# EAGLE design nonary (EAGLE 9.5.2)
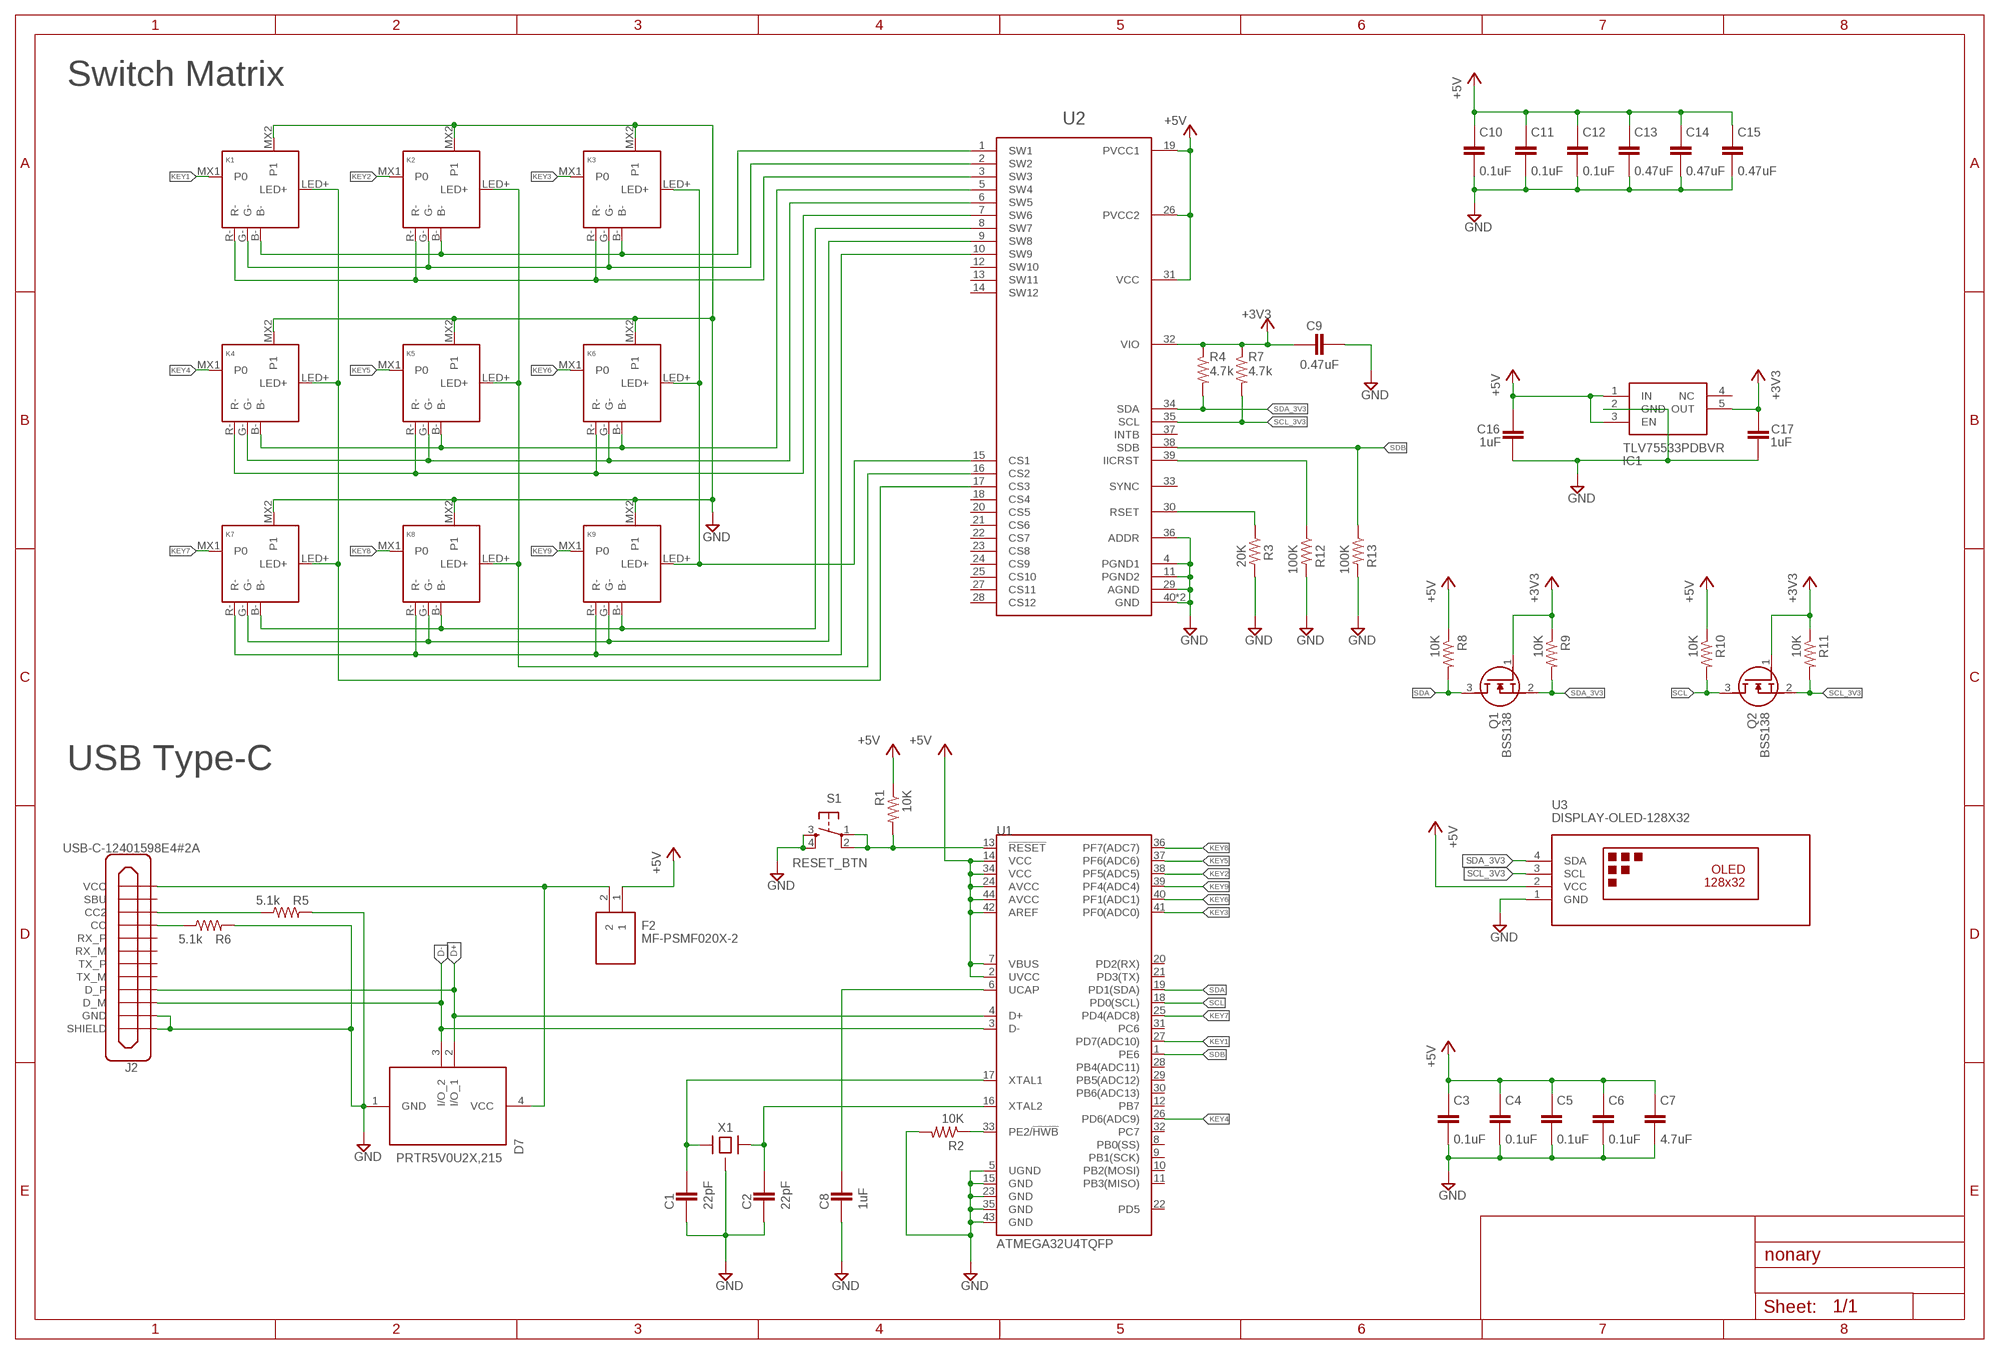
[diagram p0: schematic, sheet 1]

## Parts
C1  22pF  CAPACITOR-0603  [C0603]
C2  22pF  CAPACITOR-0603  [C0603]
C3  0.1uF  CAPACITOR-0603  [C0603]
C4  0.1uF  CAPACITOR-0603  [C0603]
C5  0.1uF  CAPACITOR-0603  [C0603]
C6  0.1uF  CAPACITOR-0603  [C0603]
C7  4.7uF  CAPACITOR-0603  [C0603]
C8  1uF  CAPACITOR-0603  [C0603]
C9  0.47uF  CAPACITOR-0603  [C0603]
C10  0.1uF  CAPACITOR-0603  [C0603]
C11  0.1uF  CAPACITOR-0603  [C0603]
C12  0.1uF  CAPACITOR-0603  [C0603]
C13  0.47uF  CAPACITOR-0603  [C0603]
C14  0.47uF  CAPACITOR-0603  [C0603]
C15  0.47uF  CAPACITOR-0603  [C0603]
C16  1uF  CAPACITOR-0603  [C0603]
C17  1uF  CAPACITOR-0603  [C0603]
D7  PRTR5V0U2X,215  [SOT-143B]
F2  MF-PSMF020X-2  [FUSC2214X85N]
IC1  TLV75533PDBVR  [SOT95P280X145-5N]
J2  USB-C-12401598E4#2A  [12401598E4#2A]
K1  KEYSWITCH-RGBSMDLED-MXHSPCB-1U-SMDRGB  [MXHSPCB-1U-SMDRGB]
K2  KEYSWITCH-RGBSMDLED-MXHSPCB-1U-SMDRGB  [MXHSPCB-1U-SMDRGB]
K3  KEYSWITCH-RGBSMDLED-MXHSPCB-1U-SMDRGB  [MXHSPCB-1U-SMDRGB]
K4  KEYSWITCH-RGBSMDLED-MXHSPCB-1U-SMDRGB  [MXHSPCB-1U-SMDRGB]
K5  KEYSWITCH-RGBSMDLED-MXHSPCB-1U-SMDRGB  [MXHSPCB-1U-SMDRGB]
K6  KEYSWITCH-RGBSMDLED-MXHSPCB-1U-SMDRGB  [MXHSPCB-1U-SMDRGB]
K7  KEYSWITCH-RGBSMDLED-MXHSPCB-1U-SMDRGB  [MXHSPCB-1U-SMDRGB]
K8  KEYSWITCH-RGBSMDLED-MXHSPCB-1U-SMDRGB  [MXHSPCB-1U-SMDRGB]
K9  KEYSWITCH-RGBSMDLED-MXHSPCB-1U-SMDRGB  [MXHSPCB-1U-SMDRGB]
Q1  BSS138  [SOT95P240X120-3N]
Q2  BSS138  [SOT95P240X120-3N]
R1  10K  R-US_R0603  [R0603]
R2  10K  R-US_R0603  [R0603]
R3  20K  R-US_R0603  [R0603]
R4  4.7k  R-US_R0603  [R0603]
R5  5.1k  R-US_R0603  [R0603]
R6  5.1k  R-US_R0603  [R0603]
R7  4.7k  R-US_R0603  [R0603]
R8  10K  R-US_R0603  [R0603]
R9  10K  R-US_R0603  [R0603]
R10  10K  R-US_R0603  [R0603]
R11  10K  R-US_R0603  [R0603]
R12  100K  R-US_R0603  [R0603]
R13  100K  R-US_R0603  [R0603]
S1  RESET_BTN  TAC_SWITCHSMD  [TACTILE-SWITCH-SMD]
U1  ATMEGA32U4TQFP  [SPARKFUN-DIGITALIC_TQFP44]
U2  IS31FL3737  [QFN-40]
U3  DISPLAY-OLED-128X32  [DISPLAY-OLED-128X32]
X1  CRYSTAL-4PIN-3.2X2.5  [CRYSTAL-3.2X2.5]

## Nets
+3V3: C9.1 C17.2 IC1.5(OUT) Q1.1(G) Q2.1(G) R4.1 R7.1 R9.1 R11.1 U2.32(VIO)
+5V: C3.2 C4.2 C5.2 C6.2 C7.2 C10.2 C11.2 C12.2 C13.2 C14.2 C15.2 C16.2 F2.1 IC1.1(IN) IC1.3(EN) R1.1 R8.1 R10.1 U1.2(UVCC) U1.7(VBUS) U1.14(VCC) U1.24(AVCC) U1.34(VCC) U1.42(AREF) U1.44(AVCC) U2.19(PVCC1) U2.26(PVCC2) U2.31(VCC) U3.2(VCC)
/RESET: R1.2 S1.1 S1.2 U1.13(!RESET)
CS1: K3.LED+ K6.LED+ K9.LED+ U2.15(CS1)
CS2: K2.LED+ K5.LED+ K8.LED+ U2.16(CS2)
CS3: K1.LED+ K4.LED+ K7.LED+ U2.17(CS3)
D+: D7.2(I/O_1) J2.A6(D_P) J2.B6(D_P) U1.4(D+)
D-: D7.3(I/O_2) J2.A7(D_M) J2.B7(D_M) U1.3(D-)
GND [VCC_5V]: C1.1 C2.1 C3.1 C4.1 C5.1 C6.1 C7.1 C8.1 C9.2 C10.1 C11.1 C12.1 C13.1 C14.1 C15.1 C16.1 C17.1 D7.1(GND) IC1.2(GND) J2.A1(GND) J2.A12(GND) J2.B1(GND) J2.B12(GND) J2.SHIELD@1(SHIELD) J2.SHIELD@2(SHIELD) J2.SHIELD@3(SHIELD) J2.SHIELD@4(SHIELD) K1.MX2(P1) K2.MX2(P1) K3.MX2(P1) K4.MX2(P1) K5.MX2(P1) K6.MX2(P1) K7.MX2(P1) K8.MX2(P1) K9.MX2(P1) R2.2 R3.2 R5.2 R6.2 R12.2 R13.2 S1.3 S1.4 U1.5(UGND) U1.15(GND) U1.23(GND) U1.35(GND) U1.43(GND) U2.4(PGND1) U2.11(PGND2) U2.29(AGND) U2.36(ADDR) U2.40(GND) U2.TAB(GND) U3.1(GND) X1.2(GND) X1.4(GND)
KEY1: K1.MX1(P0) U1.27(PD7(ADC10))
KEY2: K2.MX1(P0) U1.38(PF5(ADC5))
KEY3: K3.MX1(P0) U1.41(PF0(ADC0))
KEY4: K4.MX1(P0) U1.26(PD6(ADC9))
KEY5: K5.MX1(P0) U1.37(PF6(ADC6))
KEY6: K6.MX1(P0) U1.40(PF1(ADC1))
KEY7: K7.MX1(P0) U1.25(PD4(ADC8))
KEY8: K8.MX1(P0) U1.36(PF7(ADC7))
KEY9: K9.MX1(P0) U1.39(PF4(ADC4))
N$1: R12.1 U2.39(IICRST)
N$2: R3.1 U2.30(RSET)
N$3: J2.A5(CC) R6.1
N$4: R2.1 U1.33(PE2/!HWB)
N$5: C8.2 U1.6(UCAP)
N$13: J2.B5(CC2) R5.1
N$27: D7.4(VCC) F2.2 J2.A4(VCC) J2.A9(VCC) J2.B4(VCC) J2.B9(VCC)
SCL: Q2.3(D) R10.2 U1.18(PD0(SCL))
SCL_3V3: Q2.2(S) R7.2 R11.2 U2.35(SCL) U3.3(SCL)
SDA: Q1.3(D) R8.2 U1.19(PD1(SDA))
SDA_3V3: Q1.2(S) R4.2 R9.2 U2.34(SDA) U3.4(SDA)
SDB: R13.1 U1.1(PE6) U2.38(SDB)
SW1: K1.B- K2.B- K3.B- U2.1(SW1)
SW2: K1.G- K2.G- K3.G- U2.2(SW2)
SW3: K1.R- K2.R- K3.R- U2.3(SW3)
SW4: K4.B- K5.B- K6.B- U2.5(SW4)
SW5: K4.G- K5.G- K6.G- U2.6(SW5)
SW6: K4.R- K5.R- K6.R- U2.7(SW6)
SW7: K7.B- K8.B- K9.B- U2.8(SW7)
SW8: K7.G- K8.G- K9.G- U2.9(SW8)
SW9: K7.R- K8.R- K9.R- U2.10(SW9)
XTAL1: C1.2 U1.17(XTAL1) X1.1
XTAL2: C2.2 U1.16(XTAL2) X1.3
Unconnected: IC1.4(NC) J2.A2(TX_P) J2.A3(TX_M) J2.A8(SBU) J2.A10(RX_M) J2.A11(RX_P) J2.B2(TX_P) J2.B3(TX_M) J2.B8(SBU) J2.B10(RX_M) J2.B11(RX_P) U1.8(PB0(SS)) U1.9(PB1(SCK)) U1.10(PB2(MOSI)) U1.11(PB3(MISO)) U1.12(PB7) U1.20(PD2(RX)) U1.21(PD3(TX)) U1.22(PD5) U1.28(PB4(ADC11)) U1.29(PB5(ADC12)) U1.30(PB6(ADC13)) U1.31(PC6) U1.32(PC7) U2.12(SW10) U2.13(SW11) U2.14(SW12) U2.18(CS4) U2.20(CS5) U2.21(CS6) U2.22(CS7) U2.23(CS8) U2.24(CS9) U2.25(CS10) U2.27(CS11) U2.28(CS12) U2.33(SYNC) U2.37(INTB)

## Notes on the sheet
- Switch Matrix
- USB Type-C

## Library data of the parts
C1-C17 = Components:CAPACITOR
D7 = SamacSys_Parts:PRTR5V0U2X,215: ESD Protection Diodes 5.5V Dual SOT143B NXP PRTR5V0U2X,215 Dual Uni-Directional TVS Diode, 4-Pin SOT-143B Source: Datasheet <http://docs-emea.rs-online.com/webdocs/0f75/0900766b80f751d4.pdf>; DESCRIPTION: ESD Protection Diodes 5.5V Dual SOT143B NXP PRTR5V0U2X,215 Dual Uni-Directional TVS Diode, 4-Pin SOT-143B; HEIGHT: mm; MANUFACTURER_NAME: Nexperia; MANUFACTURER_PART_NUMBER: PRTR5V0U2X,215; MOUSER_PART_NUMBER: 771-PRTR5V0U2X-T/R; MOUSER_PRICE-STOCK: https://www.mouser.com/Search/Refine.aspx?Keyword=771-PRTR5V0U2X-T%2FR; RS_PART_NUMBER: 7258720P; RS_PRICE-STOCK: http://uk.rs-online.com/web/p/products/7258720P
F2 = SamacSys_Parts:MF-PSMF020X-2: Bourns 0.2A Surface Mount Resettable Fuse, 9V Source: Datasheet <https://www.bourns.com/pdfs/mfpsmf.pdf>; ALLIED_NUMBER: 70154470; ALLIED_PRICE-STOCK: https://www.alliedelec.com/bourns-mf-psmf020x-2/70154470/; DESCRIPTION: Bourns 0.2A Surface Mount Resettable Fuse, 9V; HEIGHT: 0.85mm; MANUFACTURER_NAME: Bourns; MANUFACTURER_PART_NUMBER: MF-PSMF020X-2; MOUSER_PART_NUMBER: 652-MF-PSMF020X-2; MOUSER_PRICE-STOCK: https://www.mouser.com/Search/Refine.aspx?Keyword=652-MF-PSMF020X-2; RS_PART_NUMBER: 6917500P; RS_PRICE-STOCK: http://uk.rs-online.com/web/p/products/6917500P
IC1 = SamacSys_Parts:TLV75533PDBVR: LDO Voltage Regulators 500-mA, Low IQ, Small Size, Low Dropout Regulator 5-SOT-23 -40 to 125 Source: Datasheet <http://www.ti.com/lit/gpn/tlv755p>; DESCRIPTION: LDO Voltage Regulators 500-mA, Low IQ, Small Size, Low Dropout Regulator 5-SOT-23 -40 to 125; HEIGHT: 1.45mm; MANUFACTURER_NAME: Texas Instruments; MANUFACTURER_PART_NUMBER: TLV75533PDBVR; MOUSER_PART_NUMBER: 595-TLV75533PDBVR; MOUSER_PRICE-STOCK: https://www.mouser.com/Search/Refine.aspx?Keyword=595-TLV75533PDBVR
J2 = USB:USB-C
K1-K9 = Keyboard:KEYSWITCH-RGBSMDLED
Q1 Q2 = SamacSys_Parts:BSS138: N-channel MOSFET,BSS138 0.2A 50V Source: Datasheet <https://www.onsemi.com/pub/Collateral/BSS138-D.PDF>; DESCRIPTION: N-channel MOSFET,BSS138 0.2A 50V; HEIGHT: 1.2mm; MANUFACTURER_NAME: ON Semiconductor; MANUFACTURER_PART_NUMBER: BSS138; MOUSER_PART_NUMBER: 512-BSS138; MOUSER_PRICE-STOCK: https://www.mouser.com/Search/Refine.aspx?Keyword=512-BSS138; RS_PART_NUMBER: 6710324P; RS_PRICE-STOCK: http://uk.rs-online.com/web/p/products/6710324P
R1-R13 = rcl:R-US_: RESISTOR, American symbol; SPICEPREFIX: R
S1 = SparkFun-Retired:TAC_SWITCH: Momentary Switch Button commonly used for reset or general input. Spark Fun Electronics SKU : COM-00097 SMT- SWCH-08247; PROD_ID: SWCH-08247; VALUE: TAC_SWITCHSMD
U1 = SparkFun-Retired:ATMEGA32U4: Atmel 44-pin 8-bit Microcontroller with 32KBytes of ISP Flash and USB Controller ----- Please use the QFN-44-NOPAD_1:1 package for the footprint of all boards using a 32U4. Route traces directly away from the pads as much as possible.; PROD_ID: IC-11161
U2 = LED:IS31FL3737
U3 = diy-modules:DISPLAY-OLED-128X32: 128x32 Dot Matrix OLED Module with I2C interface based on SSD1306 chip More details available here: http://www.tinyosshop.com/index.php?route=product/product&product_id=953 Schematic available here: http://www.tinyosshop.com/datasheet/OLED%2012832.pdf SSD1306 datasheet: https://cdn-shop.adafruit.com/datasheets/SSD1306.pdf Click here to find device on ebay.com <http://www.ebay.com/sch/oled+display+128x32+i2c>
X1 = Components:CRYSTAL-4PIN

## Board
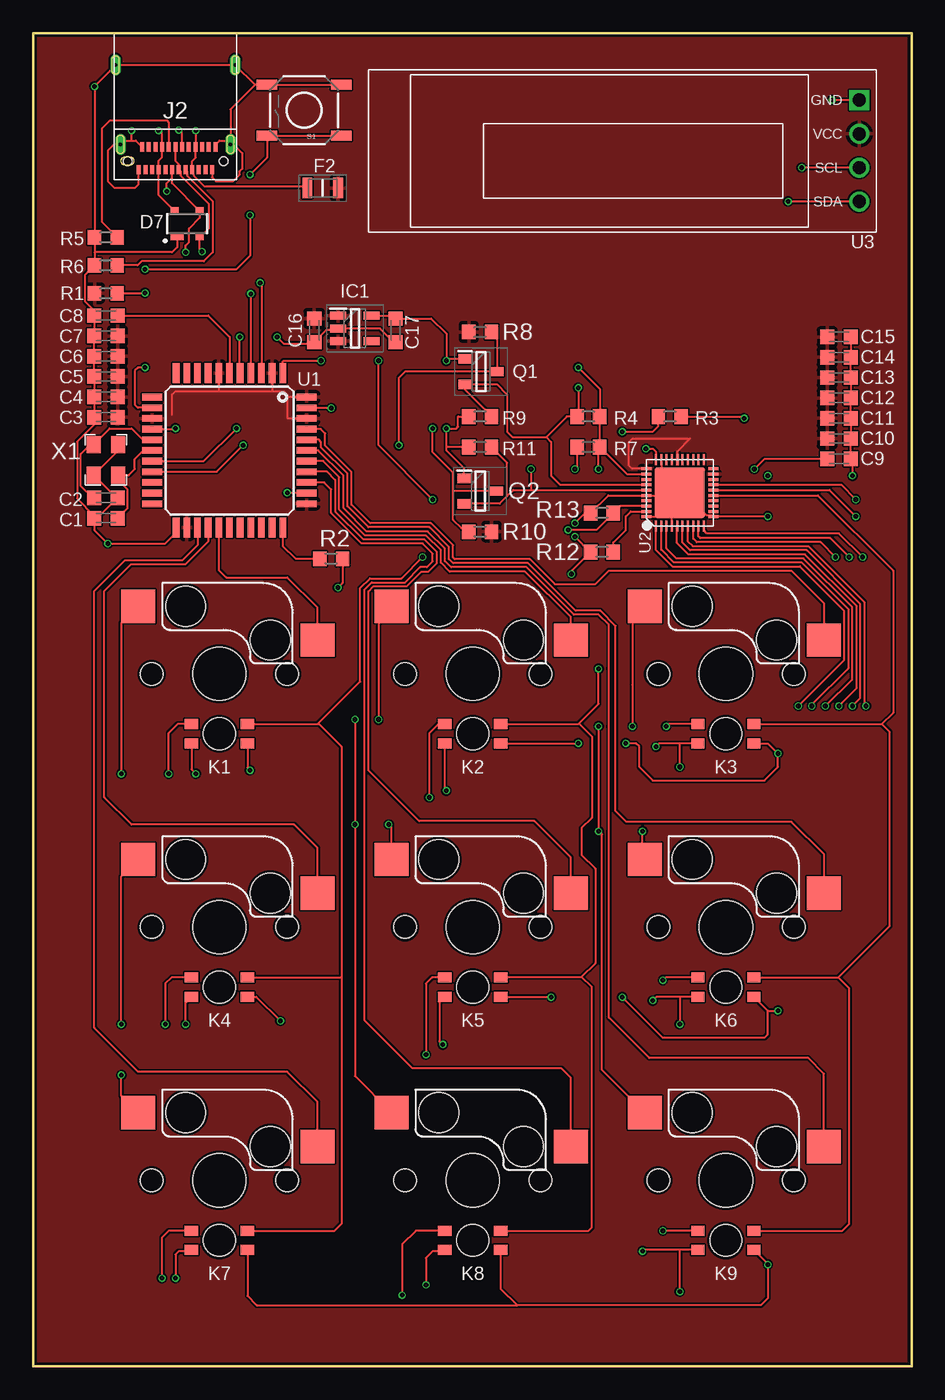
[diagram p1: board, top side]
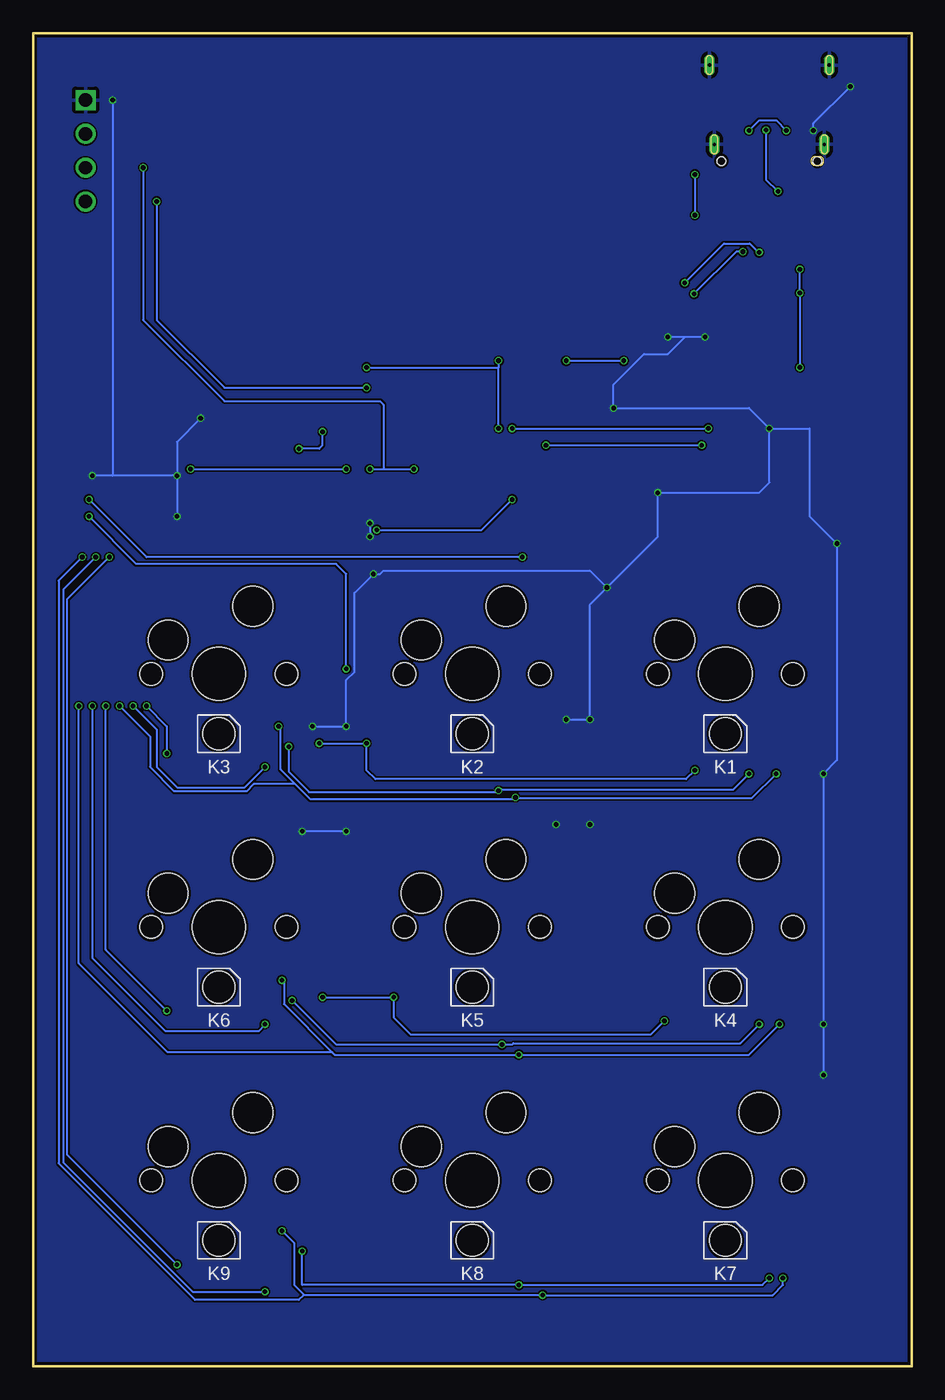
[diagram p2: board, bottom side, seen from below]

Size 65.9 x 100 mm. Coordinates in mm from the lower left corner, seen from the top.
Outline: 0,0 65.9,0 65.9,100 0,100 0,0
Copper layers (1*16): Top 0.035559375mm / dielectric 1.6mm / Bottom 0.035559375mm
Design rules "jlcpcb2layer": minimum track width 5mil, minimum drill 12mil, track to track 5mil, track to pad 5mil, pad to pad 5mil, via to via 5mil, smd to smd 5mil, copper to edge 8mil, drill to drill 6mil, minimum pad ring 5mil, minimum via ring 3mil, stop-mask expansion 2.5mil, vias tented up to drill 0mil, thermal gap 10mil

### Footprints (pad centres in the part's own frame; a part is rotated, then mirrored left to right if it is on the bottom)
C0603 = smd 1.05 x 1.08: 1 -0.875,0; 2 0.875,0
SOT-143B = smd 1 x 0.6: 1 -0.75,-0.95 | smd 0.6 x 0.6: 2 0.95,-0.95; 3 0.95,0.95; 4 -0.95,0.95
FUSC2214X85N = smd 0.72 x 1.52: 1 -1.15,0; 2 1.15,0
SOT95P280X145-5N = smd 1.2 x 0.6: 1 -1.25,0.95; 2 -1.25,0; 3 -1.25,-0.95; 4 1.25,-0.95; 5 1.25,0.95
12401598E4#2A = smd 0.3 x 0.7: A1 -2.75,0.66; A2 -2.25,0.66; A3 -1.75,0.66; A4 -1.25,0.66; A5 -0.75,0.66; A6 -0.25,0.66; A7 0.25,0.66; A8 0.75,0.66; A9 1.25,0.66; A10 1.75,0.66; A11 2.25,0.66; A12 2.75,0.66; B1 2.5,-1.04; B2 2,-1.04; B3 1.5,-1.04; B4 1,-1.04; B5 0.5,-1.04; B6 0,-1.04; B7 -0.5,-1.04; B8 -1,-1.04; B9 -1.5,-1.04; B10 -2,-1.04; B11 -2.5,-1.04; B12 -3,-1.04 | drill 0.25 pad 0.8 long: SHIELD@1 4.49,-7.2; SHIELD@2 -4.49,-7.2; SHIELD@3 4.13,-1.25; SHIELD@4 -4.13,-1.25 | hole 0.65: -3.6,0; 3.6,0
MXHSPCB-1U-SMDRGB = smd 1 x 0.75: B- 2.1,-5.225; G- -2.1,-5.225; LED+ 2.1,-3.775; R- -2.1,-3.775 | smd 2.55 x 2.5: MX1 7.36,2.54; MX2 -6.09,5.08 | hole 4: 0,0 | hole 1.7: 5.08,0; -5.08,0 | hole 3: 3.81,2.54; -2.54,5.08 | hole 2.4: 0,-4.5
SOT95P240X120-3N = smd 1 x 0.7: 1 -1.2,0.95; 2 -1.2,-0.95; 3 1.2,0
R0603 = smd 1 x 1.1: 1 -0.85,0; 2 0.85,0
TACTILE-SWITCH-SMD = smd 1.524 x 0.762: 1 -2.794,1.905; 2 2.794,1.905; 3 -2.794,-1.905; 4 2.794,-1.905
SPARKFUN-DIGITALIC_TQFP44 = smd 1.5 x 0.5: 1 -5.8,4; 2 -5.8,3.2; 3 -5.8,2.4; 4 -5.8,1.6; 5 -5.8,0.8; 6 -5.8,0; 7 -5.8,-0.8; 8 -5.8,-1.6; 9 -5.8,-2.4; 10 -5.8,-3.2; 11 -5.8,-4; 23 5.8,-4; 24 5.8,-3.2; 25 5.8,-2.4; 26 5.8,-1.6; 27 5.8,-0.8; 28 5.8,0; 29 5.8,0.8; 30 5.8,1.6; 31 5.8,2.4; 32 5.8,3.2; 33 5.8,4 | smd 0.5 x 1.5: 12 -4,-5.8; 13 -3.2,-5.8; 14 -2.4,-5.8; 15 -1.6,-5.8; 16 -0.8,-5.8; 17 0,-5.8; 18 0.8,-5.8; 19 1.6,-5.8; 20 2.4,-5.8; 21 3.2,-5.8; 22 4,-5.8; 34 4,5.8; 35 3.2,5.8; 36 2.4,5.8; 37 1.6,5.8; 38 0.8,5.8; 39 0,5.8; 40 -0.8,5.8; 41 -1.6,5.8; 42 -2.4,5.8; 43 -3.2,5.8; 44 -4,5.8
QFN-40 = smd 0.8 x 0.2: 1 -2.5,1.8; 2 -2.5,1.4; 3 -2.5,1; 4 -2.5,0.6; 5 -2.5,0.2; 6 -2.5,-0.2; 7 -2.5,-0.6; 8 -2.5,-1; 9 -2.5,-1.4; 10 -2.5,-1.8; 21 2.5,-1.8; 22 2.5,-1.4; 23 2.5,-1; 24 2.5,-0.6; 25 2.5,-0.2; 26 2.5,0.2; 27 2.5,0.6; 28 2.5,1; 29 2.5,1.4; 30 2.5,1.8 | smd 0.2 x 0.8: 11 -1.8,-2.5; 12 -1.4,-2.5; 13 -1,-2.5; 14 -0.6,-2.5; 15 -0.2,-2.5; 16 0.2,-2.5; 17 0.6,-2.5; 18 1,-2.5; 19 1.4,-2.5; 20 1.8,-2.5; 31 1.8,2.5; 32 1.4,2.5; 33 1,2.5; 34 0.6,2.5; 35 0.2,2.5; 36 -0.2,2.5; 37 -0.6,2.5; 38 -1,2.5; 39 -1.4,2.5; 40 -1.8,2.5 | smd 3.8 x 3.8: TAB 0,0
DISPLAY-OLED-128X32 = drill 1 square: 1 -17.78,-3.81 | drill 1: 2 -17.78,-1.27; 3 -17.78,1.27; 4 -17.78,3.81
CRYSTAL-3.2X2.5 = smd 1.3 x 1.05: 1 -1.15,-0.925; 2 1.15,-0.925; 3 1.15,0.925; 4 -1.15,0.925

### Placement (x,y rotation side)
C1  5.45,63.63 0 top
C2  5.45,65.15 180 top
C3  5.45,71.2 0 top
C4  5.45,72.72 0 top
C5  5.45,74.25 0 top
C6  5.45,75.77 0 top
C7  5.45,77.3 0 top
C8  5.45,78.82 0 top
C9  60.45,68.07 0 top
C10  60.45,69.6 180 top
C11  60.45,71.12 180 top
C12  60.45,72.64 180 top
C13  60.45,74.17 180 top
C14  60.45,75.69 180 top
C15  60.45,77.22 180 top
C16  21.08,77.72 90 top
C17  27.18,77.72 90 top
D7  11.54,85.72 0 top
F2  21.72,88.39 180 top
IC1  24.13,77.85 0 top
J2  10.67,90.42 180 top
K1  13.97,51.94 0 top
K2  32.97,51.94 0 top
K3  51.97,51.94 0 top
K4  13.97,32.94 0 top
K5  32.97,32.94 0 top
K6  51.97,32.94 0 top
K7  13.97,13.94 0 top
K8  32.97,13.94 0 top
K9  51.97,13.94 0 top
Q1  33.6,74.61 0 top
Q2  33.53,65.66 0 top
R1  5.45,80.5 0 top
R2  22.35,60.58 0 top
R3  47.75,71.25 0 top
R4  41.66,71.25 180 top
R5  5.45,84.7 180 top
R6  5.45,82.6 180 top
R7  41.66,68.96 180 top
R8  33.53,77.6 0 top
R9  33.53,71.25 0 top
R10  33.53,62.61 180 top
R11  33.53,68.96 0 top
R12  42.67,61.09 180 top
R13  42.67,64.01 180 top
S1  20.32,94.23 180 top
U1  14.72,68.71 270 top
U2  48.51,65.53 90 top
U3  44.2,91.19 180 top
X1  5.45,68 90 top

### Tracks (layer width: path | path; a pad name or v marks a point on that pad's centre or on a via)
+3V3  (via drill 0.35)
  Top 0.152: Q2.1 32.33,67.37 30.99,68.71 30.99,68.96 | Q1.1 32.42,75.59 31.14,75.59 v30.99,75.44 30.99,77.47 29.86,78.6 C17.2 26.98,78.8 IC1.5 | R9.1 31.88,71.25 31.88,70.48 31.75,70.36 v30.99,70.36 30.99,68.96 | v40.89,74.93 42.51,73.32 R4.1 R7.1 42.53,68.94 | 42.53,68.94 44.53,66.93 U2.32 | C9.1 54.86,68.07 v54.1,67.31 | v42.42,67.31 42.42,68.83 42.53,68.94 | R11.1 30.99,68.96
  Bottom 0.152: v30.99,75.44 30.99,74.93 | v40.89,74.93 30.99,74.93 | v30.99,70.36 30.99,74.93 | v54.1,67.31 v42.42,67.31
+5V
  Top 0.152: 34.38,62.32 R10.1 | U2.26 48.31,68.63 49.28,69.6 44.96,69.6 44.7,69.34 44.7,67.56 44.94,67.33 U2.31 | 4.6,80.18 R1.1 | 10.41,71.37 10.41,72.9 10.67,73.15 13.92,73.15 | 19.05,72.71 19.05,72.9 18.8,73.15 17.92,73.15 | 19.05,72.71 19.05,71.11 U1.42 | 13.92,73.15 17.92,73.15 | U1.44 19.05,72.71 | U1.2 17.92,73.15 | U1.7 13.92,73.15
  pour Top: 0,0 65.9,0 65.9,100 0,100
/RESET  (via drill 0.35)
  Top 0.152: v8.38,74.93 7.87,74.93 7.62,74.68 7.62,72.14 7.85,71.91 U1.13 | R1.2 8.36,80.5 v8.38,80.52 | v8.38,82.3 15.24,82.3 16.26,83.31 v16.26,86.36 | v16.26,89.41 17.53,90.68 S1.2 S1.1
  Bottom 0.152: v8.38,74.93 v8.38,80.52 v8.38,82.3 | v16.26,89.41 v16.26,86.36
CS1
  Top 0.152: K3.LED+ 63.66,48.17 | 63.66,48.17 64.52,49.02 64.52,59.69 58.87,65.33 U2.15 | K6.LED+ 60.41,29.16 | 60.41,29.16 64.26,33.02 64.26,47.57 63.66,48.17 | K9.LED+ 60.71,10.16 61.21,10.67 61.21,28.36 60.41,29.16
CS2  (via drill 0.35)
  Top 0.152: K8.LED+ 41.66,10.16 41.91,10.41 41.91,28.45 41.15,29.21 | 40.89,48.17 40.99,48.17 41.91,47.24 41.91,41.15 41.15,40.39 41.15,38.35 42.16,37.34 42.16,30.23 41.15,29.21 | 40.89,48.17 42.42,49.69 v42.42,52.32 | U2.16 59.74,65.73 v61.72,63.75 | K2.LED+ 40.89,48.17 | K5.LED+ 35.12,29.21 41.15,29.21
  Bottom 0.152: v42.42,52.32 42.42,59.44 43.18,60.2 58.17,60.2 v61.72,63.75
CS3  (via drill 0.35)
  Top 0.152: K1.LED+ 21.34,48.17 | 21.34,48.17 21.43,48.17 23.11,46.48 23.11,29.21 23.11,29.16 | 21.34,48.17 24.54,51.37 24.54,58.39 25.26,59.11 27.61,59.11 v29.21,60.71 | U2.17 60.61,66.13 v61.72,65.02 | K7.LED+ 22.61,10.16 23.11,10.67 23.11,29.16 | K4.LED+ 22.56,29.16 23.11,29.16
  Bottom 0.152: v29.21,60.71 57.4,60.71 v61.72,65.02
D+  (via drill 0.35)
  Top 0.152: v16.32,80.45 U1.4 | J2.B6 10.67,90.42 10.92,90.17 J2.A6 11.04,89.64 11.04,89.32 13.16,87.2 13.16,85.34 12.59,84.78 D7.2 12.49,83.77 v12.65,83.61
  Bottom 0.152: v12.65,83.61 13.16,83.61 v16.32,80.45
D-  (via drill 0.35)
  Top 0.152: v17.02,81.28 17.12,81.18 U1.3 | 10.42,89.15 10.42,88.75 D7.3 12.49,86.15 11.68,85.34 11.68,84.33 11.43,84.07 v11.43,83.57 | 10.42,89.15 J2.A7 | J2.B7 11.17,92.49 v10.92,92.74 | v10.03,88.14 10.03,88.76 10.42,89.15
  Bottom 0.152: v10.92,92.74 10.92,89.03 v10.03,88.14 | v11.43,83.57 11.49,83.57 12.15,84.22 14.08,84.22 v17.02,81.28
GND  (via drill 0.35)
  Top 0.152: 6.1,65.15 C2.1 | J2.A12 7.87,89.72 7.87,88.65 7.62,88.39 6.1,88.39 5.59,88.9 5.59,91.19 6.08,91.67 J2.SHIELD@3 6.81,91.95 7.37,91.95 | J2.A1 13.42,89.2 13.72,88.9 14.99,88.9 15.49,89.41 15.49,89.65 15.69,89.84 15.69,91.01 15.02,91.67 J2.SHIELD@4 | J2.B12 13.67,91.65 13.97,91.95 14.52,91.95 J2.SHIELD@4 | J2.B1 7.68,91.95 7.37,91.95 | K1.MX2 6.6,55.75 v6.6,44.45 | K7.MX2 6.6,20.3 v6.6,21.84 | v6.6,25.65 6.6,36.74 K4.MX2 | K2.MX2 25.91,56.05 v25.91,48.51 | v24.13,48.51 v24.13,40.64 24.13,21.77 K8.MX2 | K5.MX2 26.88,40.43 v26.67,40.64 | v44.96,48.01 44.96,51.13 44.95,51.14 44.95,56.09 K3.MX2 | v42.42,48.01 v42.42,40.13 42.67,39.88 42.67,22.23 K9.MX2 | K6.MX2 45.72,38.18 v45.72,40.13 | 48.31,65.33 U2.TAB | U1.43 22.33,71.91 v22.35,71.88 | R2.2 23.2,58.76 v22.86,58.42 | U1.5 15.49,74.53 v15.49,77.22 | v40.39,59.44 40.39,59.65 R12.2 41.78,61.09 v40.64,62.23 | R3.2 53.21,71.25 v53.34,71.12 | v55.12,63.75 55.1,63.73 U2.11 50.92,63.83 50.54,63.83 49.04,65.33 48.31,65.33 | 4.6,83.57 R5.2 v4.6,96.01 4.6,96.04 J2.SHIELD@1 J2.SHIELD@2 16.64,96.14 | 4.6,83.57 R6.2 3.9,81.9 3.9,79.87 4.57,79.19 C8.1 C7.1 C6.1 C5.1 C4.1 C3.1 4.57,70.66 3.28,69.37 3.28,65.09 4.57,63.8 C1.1 | C2.1 4.8,63.63 C1.1 | C2.1 6.22,65.15 X1.4 6.37,68.7 X1.2 | C1.1 4.57,62.74 v5.59,61.72 9.91,61.72 10.72,62.53 U1.23 | C15.1 C14.1 C13.1 C12.1 C11.1 C10.1 C9.2 61.47,67.93 v61.47,66.8 | U2.4 47.91,63.75 | 47.91,63.75 47.91,64.93 | 47.91,64.93 48.31,65.33 | U2.40 46.04,63.75 47.91,63.75 | 46.99,65.33 U2.36 43.15,65.33 R13.2 41.4,64.01 v40.64,63.25 | 46.99,65.33 47.51,65.33 47.91,64.93 | U2.29 47.11,65.46 46.99,65.33 | U3.1 v59.94,95
  Top 0.152: 16.64,96.14 S1.4 S1.3 | 16.64,96.14 14.8,94.29 J2.SHIELD@4 | 7.37,91.95 v7.37,92.71 | D7.1 10.79,83.95 10.41,83.57 4.6,83.57 | v18.29,77.22 18.8,76.71 20.94,76.71 C16.1 21.96,77.72 22.75,77.72 IC1.2 26.04,77.85 27.04,76.85 C17.1 | U1.15 10.62,70.31 v10.67,70.36 | v19.05,65.53 20.49,65.53 U1.35
  Bottom 0.152: v6.6,21.84 v6.6,25.65 v6.6,44.45 5.59,45.47 v5.59,61.72 7.66,63.8 7.66,70.36 v10.67,70.36 | v25.91,48.51 v24.13,48.51 24.13,57.15 v22.86,58.42 | v44.96,48.01 v42.42,48.01 42.42,51.47 41.81,52.07 41.81,58.01 v40.39,59.44 39.88,59.44 39.62,59.69 24.13,59.69 v22.86,58.42 | v42.42,40.13 v45.72,40.13 | v53.34,71.12 55.12,69.34 v55.12,66.8 | v55.12,66.8 v55.12,63.75 | v55.12,66.8 59.94,66.8 | 59.94,66.8 v61.47,66.8 | v59.94,95 59.94,66.8 | v7.37,92.71 7.37,93.24 v4.6,96.01 | v15.49,77.22 17.02,77.22 | 17.02,77.22 v18.29,77.22 | 17.02,77.22 18.29,75.95 20.07,75.95 22.35,73.66 v22.35,71.88 12.19,71.88 v10.67,70.36 | v22.86,58.42 19.05,62.23 v19.05,65.53 11.43,65.53 10.67,66.29 v10.67,70.36 | v40.64,63.25 v40.64,62.23
  pour Bottom: 0,0 65.9,0 65.9,100 0,100
KEY1
  Top 0.152: U1.27 13.92,59.74 14.48,59.18 19.05,59.18 21.33,56.9 K1.MX1
KEY2
  Top 0.152: K2.MX1 40.33,56.19 36.91,59.62 31.24,59.62 30.58,60.28 30.58,61.22 29.46,62.33 24.89,62.33 22.96,64.26 22.96,66.7 21.75,67.91 U1.38
KEY3
  Top 0.152: K3.MX1 59.33,57.26 56.9,59.69 43.18,59.69 42.16,58.67 39.14,58.67 37.26,60.55 31.62,60.55 31.5,60.68 31.5,61.59 29.84,63.25 25.27,63.25 23.88,64.64 23.88,67.08 21.89,69.06 21.89,69.98 21.56,70.31 U1.41
KEY4
  Top 0.152: U1.26 13.12,61.89 11.38,60.15 7.32,60.15 5.33,58.17 5.33,42.67 7.37,40.64 19.56,40.64 21.33,38.87 K4.MX1
KEY5
  Top 0.152: K5.MX1 40.33,38.16 37.59,40.89 28.96,40.89 25.15,44.7 25.15,58.14 25.51,58.5 28.02,58.5 29.14,59.62 29.64,59.62 30.28,60.25 30.28,61.09 29.64,61.72 29.34,62.03 24.76,62.03 22.66,64.13 22.66,66.5 22.05,67.11 U1.37
KEY6
  Top 0.152: K6.MX1 59.33,38.41 56.9,40.85 44.5,40.85 43.69,41.66 43.69,55.55 42.54,56.69 40.69,56.69 37.13,60.25 31.5,60.25 31.19,60.55 31.19,61.47 29.72,62.94 25.15,62.94 23.57,64.52 23.57,66.95 21.59,68.93 21.59,69.34 21.43,69.51 U1.40
KEY7
  Top 0.152: U1.25 12.32,61.59 11.18,60.45 6.86,60.45 4.57,58.17 4.57,25.4 7.87,22.1 19.05,22.1 21.33,19.82 K7.MX1
KEY8
  Top 0.152: K8.MX1 40.33,21.65 39.62,22.35 28.45,22.35 24.84,25.96 24.84,58.26 25.38,58.81 27.89,58.81 29.03,59.94 29.54,59.94 29.97,60.38 29.97,60.96 29.21,61.72 24.64,61.72 22.35,64.01 22.35,65.79 21.83,66.31 U1.36
KEY9
  Top 0.152: K9.MX1 59.33,21.95 58.17,23.11 46.23,23.11 43.18,26.16 43.18,55.63 42.42,56.39 40.56,56.39 37.01,59.94 31.34,59.94 30.89,60.4 30.89,61.34 29.59,62.64 25.02,62.64 23.27,64.39 23.27,66.83 21.39,68.71 U1.39
N$1
  Top 0.152: R12.1 43.52,61.81 44.45,62.74 44.45,63.75 44.83,64.13 U2.39
N$2  (via drill 0.35)
  Top 0.152: v44.2,70.1 46.48,70.1 46.9,70.52 R3.1 | v45.97,68.83 46.48,68.83 46.71,68.6 U2.30
  Bottom 0.152: v44.2,70.1 44.2,69.09 44.45,68.83 v45.97,68.83
N$3
  Top 0.152: J2.A5 11.54,89.64 11.54,89.32 13.46,87.4 13.46,83.57 12.8,82.9 8.13,82.9 7.83,82.6 R6.1
N$4
  Top 0.152: U1.33 18.72,61.55 19.68,60.58 R2.1
N$5
  Top 0.152: C8.2 13.13,78.82 14.73,77.22 14.73,74.52 U1.6
N$13
  Top 0.152: R5.1 5.14,85.86 5.14,92.84 5.77,93.47 10.02,93.47 10.17,93.31 J2.B5
N$27  (via drill 0.35)
  Top 0.152: D7.4 9.42,87.85 J2.A9 9.42,90.44 9.67,90.69 J2.B4 9.65,91.48 9.65,92.46 v9.4,92.71 | v12.19,92.71 12.17,92.69 J2.B9 12.19,91.44 12.19,90.68 11.92,90.4 J2.A4 11.92,89.51 12.04,89.39 12.04,89.32 12.86,88.5 20.46,88.5 F2.2
  Bottom 0.152: v12.19,92.71 11.43,93.47 10.16,93.47 v9.4,92.71
SCL  (via drill 0.35)
  Top 0.152: v29.97,70.36 29.97,68.58 31.5,67.06 31.5,65.79 | R10.2 32.42,62.87 32.13,62.87 31.5,63.5 31.5,65.79 | U1.18 12.79,67.91 v15.24,70.36 | Q2.3 31.62,65.66 31.5,65.79
  Bottom 0.152: v29.97,70.36 v15.24,70.36
SCL_3V3  (via drill 0.35)
  Top 0.152: 35.56,65.28 34.99,64.71 Q2.2 | 35.56,65.28 35.56,67.78 R11.2 | U3.3 v57.66,89.92 | 35.56,65.28 36.01,65.73 37.34,65.73 | 37.34,65.73 U2.35 | R7.2 40.81,67.48 v40.64,67.31 | v37.34,67.31 37.34,65.73
  Bottom 0.152: v57.66,89.92 57.66,78.49 51.56,72.39 39.88,72.39 39.62,72.14 39.62,67.31 | v40.64,67.31 39.62,67.31 | 39.62,67.31 v37.34,67.31
SDA  (via drill 0.35)
  Top 0.152: v27.43,69.09 27.43,74.17 27.88,74.61 Q1.3 34.8,77.18 R8.2 | U1.19 13.77,67.11 v15.75,69.09
  Bottom 0.152: v27.43,69.09 v15.75,69.09
SDA_3V3  (via drill 0.35)
  Top 0.152: R9.2 34.38,71.29 32,73.67 Q1.2 34.79,73.67 35.56,72.9 35.56,70.1 35.95,69.71 38.49,69.71 | U3.4 v56.64,87.38 | 38.49,69.71 38.86,69.34 38.86,66.8 39.53,66.13 U2.34 | 38.49,69.71 40.03,71.25 R4.2 40.89,71.33 v40.89,73.41
  Bottom 0.152: v56.64,87.38 56.64,78.49 51.56,73.41 v40.89,73.41
SDB  (via drill 0.35)
  Top 0.152: U2.38 46,64.52 44.03,64.52 R13.1 42.25,62.74 v40.13,62.74 | v29.97,65.02 25.91,69.09 v25.91,75.44 | U1.1 18.72,75.36 18.8,75.44 v21.59,75.44
  Bottom 0.152: v40.13,62.74 32.26,62.74 v29.97,65.02 | v25.91,75.44 v21.59,75.44
SW1  (via drill 0.35)
  Top 0.152: v44.45,46.74 45.21,46.74 45.47,46.48 45.47,44.96 46.48,43.94 54.86,43.94 55.88,44.96 v55.88,45.97 55.14,46.72 K3.B- | K1.B- 16.07,44.89 v16.26,44.7 | v57.4,49.53 60.83,52.96 60.83,56.69 57.53,59.99 47.95,59.99 46.71,61.24 U2.1 | v40.89,46.74 40.88,46.72 K2.B-
  Bottom 0.152: v44.45,46.74 v40.89,46.74 40.89,44.7 40.23,44.04 16.92,44.04 v16.26,44.7 | v57.4,49.53 55.88,48.01 v55.88,45.97
SW2  (via drill 0.35)
  Top 0.152: K3.G- 48.51,46.72 | 48.51,46.72 46.97,46.72 v46.74,46.48 | v30.99,43.18 30.87,43.3 K2.G- | K1.G- 11.87,44.77 v12.19,44.45 | v58.42,49.53 58.42,49.63 61.14,52.35 61.14,56.82 57.66,60.3 48.08,60.3 47.11,61.27 U2.2 | v48.51,44.96 48.51,46.72
  Bottom 0.152: v46.74,46.48 46.74,44.61 45.21,43.08 31.09,43.08 v30.99,43.18 30.89,43.28 13.36,43.28 v12.19,44.45 | v58.42,49.53 56.64,47.75 56.64,44.96 55.12,43.43 50.04,43.43 v48.51,44.96
SW3  (via drill 0.35)
  Top 0.152: K3.R- 47.66,48.17 v47.5,48.01 | v29.72,42.67 29.72,47.5 30.39,48.17 K2.R- | v10.16,44.45 10.16,47.5 10.83,48.17 K1.R- | v59.44,49.53 61.44,51.54 61.44,56.94 57.78,60.6 48.26,60.6 47.51,61.35 U2.3
  Bottom 0.152: v47.5,48.01 47.34,47.85 47.34,44.78 46.24,43.68 | 46.24,43.68 45.08,42.52 29.87,42.52 v29.72,42.67 29.67,42.62 11.99,42.62 v10.16,44.45 | 46.24,43.68 49.36,43.68 49.91,43.13 55.32,43.13 57.15,44.96 57.15,47.24 v59.44,49.53
SW4  (via drill 0.35)
  Top 0.152: K6.B- 55.12,26.67 | v44.2,27.69 47.24,24.64 54.86,24.64 55.12,24.89 55.12,26.67 | K4.B- 16.73,27.71 v18.54,25.91 | 55.12,26.67 v55.88,26.67 | v60.45,49.53 61.75,50.83 61.75,57.07 57.91,60.91 49.15,60.91 48.3,61.76 48.3,63.02 U2.5 | K5.B- 38.83,27.71 v38.86,27.69
  Bottom 0.152: v44.2,27.69 v38.86,27.69 38.86,26.16 37.59,24.89 19.56,24.89 v18.54,25.91 | v55.88,26.67 60.45,31.24 v60.45,49.53
SW5  (via drill 0.35)
  Top 0.152: K6.G- 48.51,27.71 | 48.51,27.71 46.77,27.71 v46.48,27.43 | K5.G- 30.48,27.32 30.48,24.38 v30.73,24.13 | v11.43,25.65 11.43,27.27 K4.G- | 48.51,27.71 v48.51,25.65 | U2.6 48.71,61.78 49.28,61.21 58.03,61.21 62.05,57.2 62.05,50.12 v61.47,49.53
  Bottom 0.152: v46.48,27.43 43.18,24.13 v30.73,24.13 29.97,24.13 29.87,24.23 12.86,24.23 v11.43,25.65 | v48.51,25.65 48.51,25.63 49.01,25.13 55.96,25.13 61.47,30.64 v61.47,49.53
SW6  (via drill 0.35)
  Top 0.152: K6.R- 47.45,29.16 v47.24,28.96 | K5.R- 29.93,29.16 29.46,28.7 v29.46,23.37 | v9.91,25.65 9.91,28.7 10.37,29.16 K4.R- | v62.48,49.53 62.36,49.66 62.36,57.32 58.16,61.52 49.48,61.52 49.11,61.88 U2.7
  Bottom 0.152: 43.47,23.56 47.09,27.18 47.09,28.8 v47.24,28.96 | v9.91,25.65 12.19,23.37 v29.46,23.37 43.28,23.37 43.47,23.56 | 43.47,23.56 55.81,23.56 62.48,30.23 v62.48,49.53
SW7  (via drill 0.35)
  Top 0.152: K9.B- 55.12,7.67 v55.12,7.62 55.12,5.08 54.61,4.57 36.32,4.57 | K7.B- 16.07,5.27 16.76,4.57 36.32,4.57 | v60.2,60.71 59.08,61.82 49.78,61.82 49.51,62.09 U2.8 | K8.B- 35.07,5.82 36.32,4.57
  Bottom 0.152: v55.12,7.62 63.34,15.85 63.34,57.56 v60.2,60.71
SW8  (via drill 0.35)
  Top 0.152: K9.G- 48.51,8.71 | 48.51,8.71 45.8,8.71 v45.72,8.64 | K8.G- 30.79,8.64 29.97,8.64 29.46,8.13 v29.46,6.1 | K7.G- 11.79,8.64 10.92,8.64 10.67,8.38 v10.67,6.6 | v48.51,5.59 48.51,8.71 | v61.21,60.71 59.79,62.13 50.04,62.13 49.91,62.25 U2.9
  Bottom 0.152: v45.72,8.64 45.72,6.1 v29.46,6.1 11.18,6.1 v10.67,6.6 | v48.51,5.59 53.94,5.59 63.65,15.29 63.65,58.27 v61.21,60.71
SW9  (via drill 0.35)
  Top 0.152: K9.R- v47.24,10.16 | v9.65,6.6 9.65,9.65 10.16,10.16 K7.R- | v27.69,5.33 27.69,9.14 28.71,10.16 K8.R- | v62.23,60.71 60.45,62.48 50.55,62.48 50.31,62.72 U2.10
  Bottom 0.152: v47.24,10.16 46.33,9.24 46.33,6.1 45.56,5.33 | v9.65,6.6 9.65,6.1 10.41,5.33 v27.69,5.33 45.56,5.33 | 45.56,5.33 45.62,5.33 45.98,4.98 53.77,4.98 64.01,15.22 64.01,58.93 v62.23,60.71
XTAL1
  Top 0.152: C1.2 7.08,64.38 7.08,65.79 6.37,66.49 X1.1 7.16,66.85 7.62,67.31 7.62,68.07 8.26,68.71 U1.17
XTAL2
  Top 0.152: C2.2 4.45,65.15 3.56,66.04 3.56,68.44 4.27,69.15 X1.3 5.73,70.36 7.37,70.36 8.22,69.51 U1.16